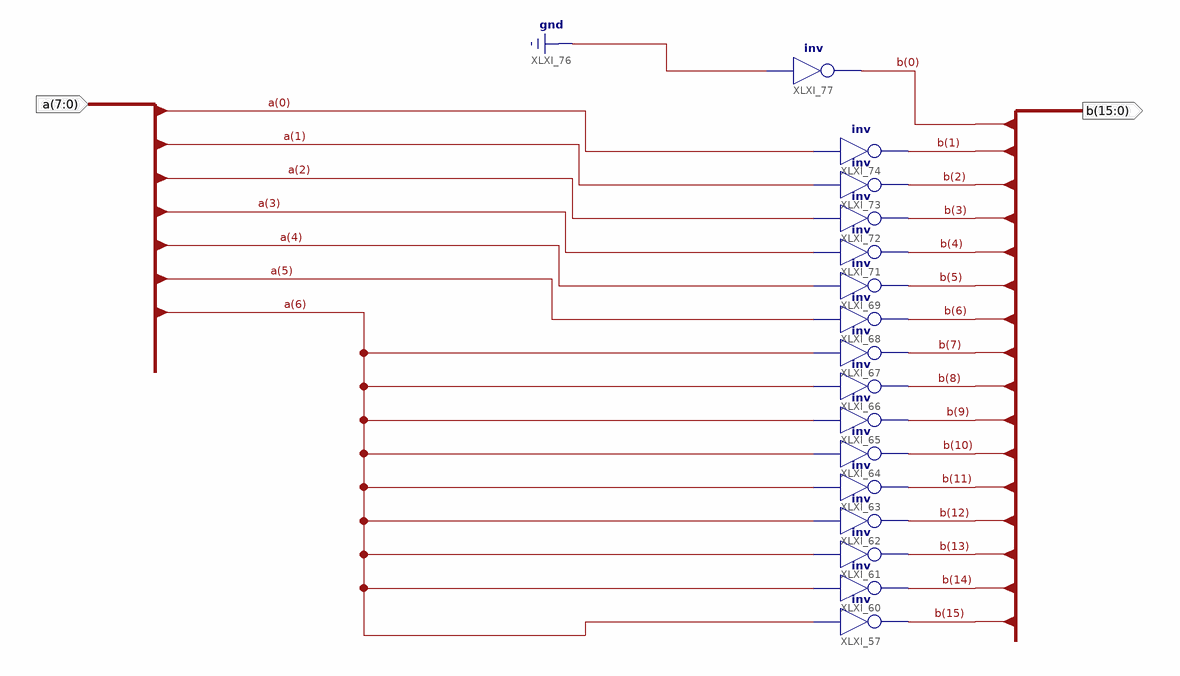
[diagram p0: schematic sheet 1]
// Xilinx ISE schematic MultiplyAndInver_8x16.sch (spartan3a) as structural Verilog: 16 symbols, 2 ports
module MultiplyAndInver_8x16 (
  input  [7:0] a,
  output [15:0] b
);

  not XLXI_77 (b[0], 1'b0);
  not XLXI_74 (b[1], a[0]);
  not XLXI_73 (b[2], a[1]);
  not XLXI_72 (b[3], a[2]);
  not XLXI_71 (b[4], a[3]);
  not XLXI_69 (b[5], a[4]);
  not XLXI_68 (b[6], a[5]);
  not XLXI_67 (b[7], a[6]);
  not XLXI_66 (b[8], a[6]);
  not XLXI_65 (b[9], a[6]);
  not XLXI_64 (b[10], a[6]);
  not XLXI_63 (b[11], a[6]);
  not XLXI_62 (b[12], a[6]);
  not XLXI_61 (b[13], a[6]);
  not XLXI_60 (b[14], a[6]);
  not XLXI_57 (b[15], a[6]);
endmodule
